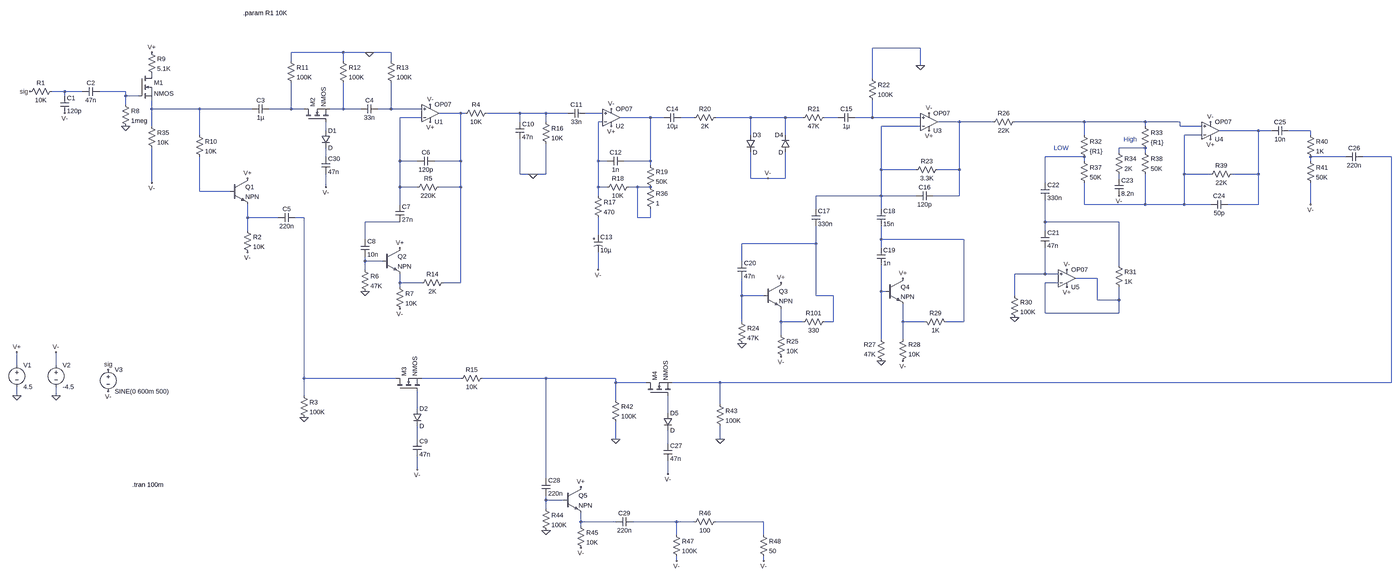
[diagram p0: schematic pedal design.asc, whole sheet]
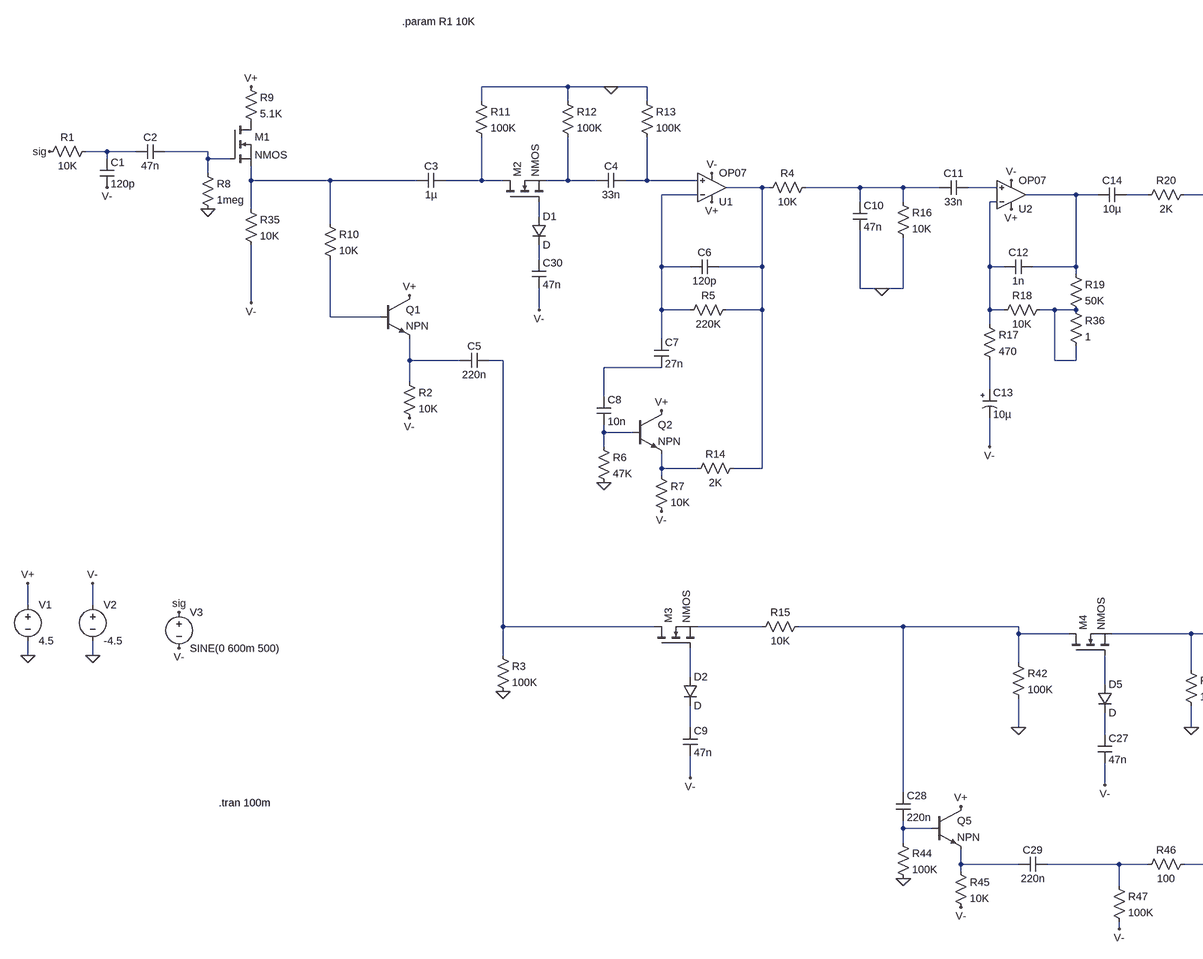
[diagram p1: schematic pedal design.asc, part, row 1 of 1, column 1 of 2]
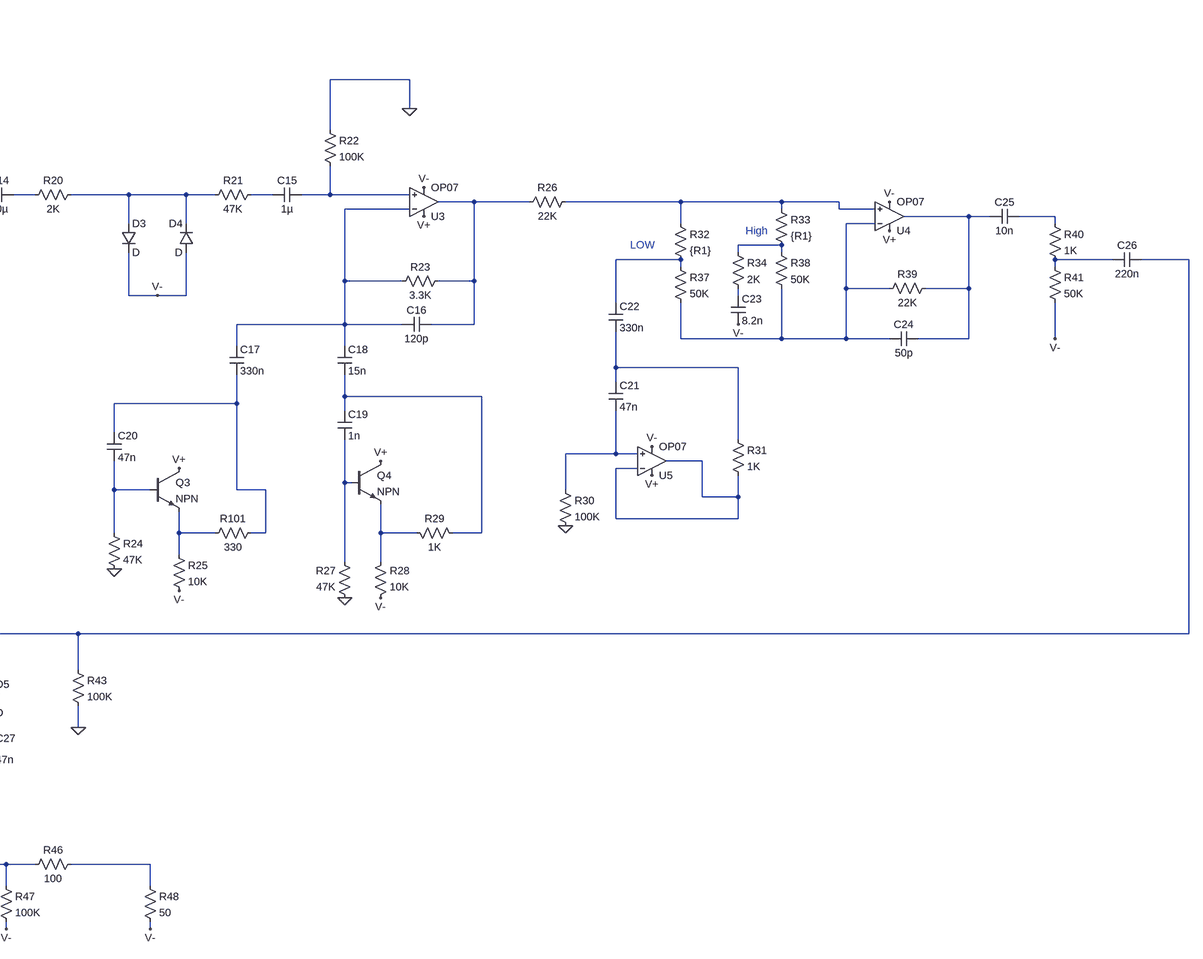
[diagram p2: schematic pedal design.asc, part, row 1 of 1, column 2 of 2]
pedal design.asc, the LTspice schematic file:
Version 4
SHEET 1 4968 1980
WIRE 3168 32 2992 32
WIRE 1040 48 848 48
WIRE 1136 48 1040 48
WIRE 1216 48 1136 48
WIRE 848 80 848 48
WIRE 1040 80 1040 48
WIRE 1216 80 1216 48
WIRE 3168 96 3168 32
WIRE 2992 144 2992 32
WIRE 16 192 -32 192
WIRE 80 192 16 192
WIRE 240 192 144 192
WIRE 16 208 16 192
WIRE 240 208 240 192
WIRE 288 208 240 208
WIRE 240 240 240 208
WIRE 336 256 336 224
WIRE 512 256 336 256
WIRE 704 256 512 256
WIRE 848 256 848 160
WIRE 848 256 768 256
WIRE 896 256 848 256
WIRE 1040 256 1040 160
WIRE 1040 256 992 256
WIRE 1104 256 1040 256
WIRE 1216 256 1216 160
WIRE 1216 256 1168 256
WIRE 1328 256 1216 256
WIRE 1472 272 1392 272
WIRE 1488 272 1472 272
WIRE 1696 272 1568 272
WIRE 1792 272 1696 272
WIRE 1872 272 1792 272
WIRE 2000 272 1936 272
WIRE 1328 288 1248 288
WIRE 2176 288 2064 288
WIRE 2224 288 2176 288
WIRE 2336 288 2288 288
WIRE 2544 288 2416 288
WIRE 2672 288 2544 288
WIRE 2736 288 2672 288
WIRE 2864 288 2816 288
WIRE 2992 288 2992 224
WIRE 2992 288 2928 288
WIRE 3168 288 2992 288
WIRE 1696 304 1696 272
WIRE 1792 304 1792 272
WIRE 2000 304 1984 304
WIRE 3312 304 3232 304
WIRE 3488 304 3312 304
WIRE 3824 304 3568 304
WIRE 4048 304 3824 304
WIRE 4176 304 4048 304
WIRE 336 320 336 256
WIRE 3168 320 3024 320
WIRE 4048 320 4048 304
WIRE 4176 320 4176 304
WIRE 4256 320 4176 320
WIRE 976 336 976 304
WIRE 4464 336 4320 336
WIRE 4512 336 4464 336
WIRE 4656 336 4576 336
WIRE 512 352 512 256
WIRE 2544 352 2544 288
WIRE 2672 352 2672 288
WIRE 3824 352 3824 304
WIRE 4256 352 4192 352
WIRE 4656 352 4656 336
WIRE 4048 400 3952 400
WIRE 3952 416 3952 400
WIRE 4048 416 4048 400
WIRE 976 432 976 400
WIRE 3824 432 3680 432
WIRE 4784 432 4656 432
WIRE 4960 432 4848 432
WIRE 1248 448 1248 288
WIRE 1312 448 1248 448
WIRE 1472 448 1472 272
WIRE 1472 448 1376 448
WIRE 1984 448 1984 304
WIRE 2016 448 1984 448
WIRE 2176 448 2176 288
WIRE 2176 448 2080 448
WIRE 3824 448 3824 432
WIRE 4656 448 4656 432
WIRE 2176 464 2176 448
WIRE 3024 480 3024 320
WIRE 3152 480 3024 480
WIRE 3312 480 3312 304
WIRE 3312 480 3232 480
WIRE 1696 496 1696 368
WIRE 1744 496 1696 496
WIRE 1792 496 1792 384
WIRE 1792 496 1744 496
WIRE 4192 496 4192 352
WIRE 4288 496 4192 496
WIRE 4464 496 4464 336
WIRE 4464 496 4368 496
WIRE 2544 512 2544 416
WIRE 2608 512 2544 512
WIRE 2672 512 2672 416
WIRE 2672 512 2608 512
WIRE 3952 512 3952 496
WIRE 336 528 336 400
WIRE 3680 528 3680 432
WIRE 976 544 976 496
WIRE 1248 544 1248 448
WIRE 1312 544 1248 544
WIRE 1472 544 1472 448
WIRE 1472 544 1392 544
WIRE 1984 544 1984 448
WIRE 2016 544 1984 544
WIRE 2128 544 2096 544
WIRE 2176 544 2128 544
WIRE 512 560 512 432
WIRE 624 560 512 560
WIRE 1984 576 1984 544
WIRE 3024 576 3024 480
WIRE 3024 576 2784 576
WIRE 3152 576 3024 576
WIRE 3312 576 3312 480
WIRE 3312 576 3216 576
WIRE 1248 608 1248 544
WIRE 3824 608 3824 528
WIRE 4048 608 4048 496
WIRE 4048 608 3824 608
WIRE 4192 608 4192 496
WIRE 4192 608 4048 608
WIRE 4288 608 4192 608
WIRE 4464 608 4464 496
WIRE 4464 608 4352 608
WIRE 4656 608 4656 528
WIRE 2784 624 2784 576
WIRE 3024 624 3024 576
WIRE 688 656 688 608
WIRE 800 656 688 656
WIRE 896 656 864 656
WIRE 2128 656 2128 544
WIRE 2176 656 2176 624
WIRE 2176 656 2128 656
WIRE 1248 672 1120 672
WIRE 3680 672 3680 592
WIRE 3952 672 3680 672
WIRE 688 704 688 656
WIRE 3680 704 3680 672
WIRE 1984 720 1984 656
WIRE 1120 736 1120 672
WIRE 3024 736 3024 688
WIRE 3328 736 3024 736
WIRE 2784 752 2784 688
WIRE 2784 752 2512 752
WIRE 3024 768 3024 736
WIRE 1120 816 1120 800
WIRE 1184 816 1120 816
WIRE 2512 816 2512 752
WIRE 3952 832 3952 672
WIRE 1120 848 1120 816
WIRE 1984 848 1984 784
WIRE 3680 864 3680 768
WIRE 3680 864 3568 864
WIRE 3728 864 3680 864
WIRE 3872 880 3792 880
WIRE 1248 896 1248 864
WIRE 1328 896 1248 896
WIRE 1472 896 1472 544
WIRE 1472 896 1408 896
WIRE 3728 896 3680 896
WIRE 1248 912 1248 896
WIRE 3024 928 3024 832
WIRE 3040 928 3024 928
WIRE 2512 944 2512 880
WIRE 2592 944 2512 944
WIRE 2784 944 2784 752
WIRE 2848 944 2784 944
WIRE 3568 944 3568 864
WIRE 3872 960 3872 880
WIRE 3952 960 3952 912
WIRE 3952 960 3872 960
WIRE 3680 1008 3680 896
WIRE 3952 1008 3952 960
WIRE 3952 1008 3680 1008
WIRE 2512 1040 2512 944
WIRE 2656 1040 2656 992
WIRE 2736 1040 2656 1040
WIRE 2848 1040 2848 944
WIRE 2848 1040 2816 1040
WIRE 3104 1040 3104 976
WIRE 3184 1040 3104 1040
WIRE 3328 1040 3328 736
WIRE 3328 1040 3264 1040
WIRE 2656 1088 2656 1040
WIRE 3024 1104 3024 928
WIRE 3104 1104 3104 1040
WIRE -160 1200 -160 1152
WIRE -16 1200 -16 1152
WIRE 896 1248 896 656
WIRE 1232 1248 896 1248
WIRE 1472 1248 1328 1248
WIRE 1792 1248 1552 1248
WIRE 2048 1248 1792 1248
WIRE 2048 1264 2048 1248
WIRE 2160 1264 2048 1264
WIRE 2432 1264 2256 1264
WIRE 4960 1264 4960 432
WIRE 4960 1264 2432 1264
WIRE -160 1312 -160 1280
WIRE -16 1312 -16 1280
WIRE 896 1312 896 1248
WIRE 2048 1328 2048 1264
WIRE 2432 1344 2432 1264
WIRE 1312 1360 1312 1296
WIRE 2240 1376 2240 1312
WIRE 1312 1472 1312 1424
WIRE 2048 1472 2048 1408
WIRE 2432 1472 2432 1424
WIRE 2240 1488 2240 1440
WIRE 1312 1584 1312 1536
WIRE 2240 1600 2240 1552
WIRE 1792 1616 1792 1248
WIRE 1792 1696 1792 1680
WIRE 1856 1696 1792 1696
WIRE 1792 1728 1792 1696
WIRE 1920 1776 1920 1744
WIRE 2048 1776 1920 1776
WIRE 2272 1776 2112 1776
WIRE 2336 1776 2272 1776
WIRE 2592 1776 2416 1776
WIRE 1920 1792 1920 1776
WIRE 2272 1824 2272 1776
WIRE 2592 1824 2592 1776
WIRE 2272 1920 2272 1904
WIRE 2592 1920 2592 1904
FLAG 1136 48 0
FLAG 896 1392 0
FLAG 1120 928 0
FLAG 3168 96 0
FLAG 2512 1120 0
FLAG 3024 1184 0
FLAG 3568 1024 0
FLAG -160 1312 0
FLAG -16 1312 0
FLAG -160 1152 V+
FLAG -16 1152 V-
FLAG 240 320 0
FLAG 336 48 V+
FLAG 336 528 V-
FLAG 16 272 V-
FLAG 688 512 V+
FLAG 1360 304 V+
FLAG 1360 240 V-
FLAG 1248 768 V+
FLAG 1248 992 V-
FLAG 688 784 V-
FLAG 1744 496 0
FLAG 2032 320 V+
FLAG 2032 256 V-
FLAG 1984 848 V-
FLAG 2608 512 V-
FLAG 3200 336 V+
FLAG 3200 272 V-
FLAG 2656 896 V+
FLAG 3104 880 V+
FLAG 2656 1168 V-
FLAG 3104 1184 V-
FLAG 3760 912 V+
FLAG 3760 848 V-
FLAG 3952 576 V-
FLAG 4288 368 V+
FLAG 4288 304 V-
FLAG 4656 608 V-
FLAG 1312 1584 V-
FLAG 2240 1600 V-
FLAG 2048 1472 0
FLAG 2432 1472 0
FLAG 1792 1808 0
FLAG 1920 1648 V+
FLAG 1920 1872 V-
FLAG 2272 1920 V-
FLAG 2592 1920 V-
FLAG -112 192 sig
FLAG 176 1216 sig
FLAG 176 1296 V-
FLAG 976 544 V-
SYMBOL res -16 176 R90
WINDOW 0 0 56 VBottom 2
WINDOW 3 32 56 VTop 2
SYMATTR InstName R1
SYMATTR Value 10K
SYMBOL cap 0 208 R0
SYMATTR InstName C1
SYMATTR Value 120p
SYMBOL cap 144 176 R90
WINDOW 0 0 32 VBottom 2
WINDOW 3 32 32 VTop 2
SYMATTR InstName C2
SYMATTR Value 47n
SYMBOL res 224 224 R0
SYMATTR InstName R8
SYMATTR Value 1meg
SYMBOL res 320 32 R0
SYMATTR InstName R9
SYMATTR Value 5.1K
SYMBOL res 496 336 R0
SYMATTR InstName R10
SYMATTR Value 10K
SYMBOL nmos 288 128 R0
SYMATTR InstName M1
SYMBOL cap 768 240 R90
WINDOW 0 0 32 VBottom 2
WINDOW 3 32 32 VTop 2
SYMATTR InstName C3
SYMATTR Value 1µ
SYMBOL res 832 64 R0
SYMATTR InstName R11
SYMATTR Value 100K
SYMBOL res 1024 64 R0
SYMATTR InstName R12
SYMATTR Value 100K
SYMBOL res 1200 64 R0
SYMATTR InstName R13
SYMATTR Value 100K
SYMBOL cap 1168 240 R90
WINDOW 0 0 32 VBottom 2
WINDOW 3 32 32 VTop 2
SYMATTR InstName C4
SYMATTR Value 33n
SYMBOL nmos 896 304 R270
SYMATTR InstName M2
SYMBOL diode 960 336 R0
SYMATTR InstName D1
SYMBOL npn 624 512 R0
SYMATTR InstName Q1
SYMBOL res 672 688 R0
SYMATTR InstName R2
SYMATTR Value 10K
SYMBOL res 880 1296 R0
SYMATTR InstName R3
SYMATTR Value 100K
SYMBOL cap 864 640 R90
WINDOW 0 0 32 VBottom 2
WINDOW 3 32 32 VTop 2
SYMATTR InstName C5
SYMATTR Value 220n
SYMBOL res 1584 256 R90
WINDOW 0 0 56 VBottom 2
WINDOW 3 32 56 VTop 2
SYMATTR InstName R4
SYMATTR Value 10K
SYMBOL res 1408 528 R90
WINDOW 0 0 56 VBottom 2
WINDOW 3 32 56 VTop 2
SYMATTR InstName R5
SYMATTR Value 220K
SYMBOL cap 1376 432 R90
WINDOW 0 0 32 VBottom 2
WINDOW 3 32 32 VTop 2
SYMATTR InstName C6
SYMATTR Value 120p
SYMBOL npn 1184 768 R0
SYMATTR InstName Q2
SYMBOL cap 1232 608 R0
SYMATTR InstName C7
SYMATTR Value 27n
SYMBOL cap 1104 736 R0
SYMATTR InstName C8
SYMATTR Value 10n
SYMBOL res 1104 832 R0
SYMATTR InstName R6
SYMATTR Value 47K
SYMBOL res 1232 896 R0
SYMATTR InstName R7
SYMATTR Value 10K
SYMBOL res 1424 880 R90
WINDOW 0 0 56 VBottom 2
WINDOW 3 32 56 VTop 2
SYMATTR InstName R14
SYMATTR Value 2K
SYMBOL nmos 1232 1296 R270
SYMATTR InstName M3
SYMBOL diode 1296 1360 R0
SYMATTR InstName D2
SYMBOL cap 1296 1472 R0
SYMATTR InstName C9
SYMATTR Value 47n
SYMBOL res 1568 1232 R90
WINDOW 0 0 56 VBottom 2
WINDOW 3 32 56 VTop 2
SYMATTR InstName R15
SYMATTR Value 10K
SYMBOL cap 1680 304 R0
SYMATTR InstName C10
SYMATTR Value 47n
SYMBOL cap 1936 256 R90
WINDOW 0 0 32 VBottom 2
WINDOW 3 32 32 VTop 2
SYMATTR InstName C11
SYMATTR Value 33n
SYMBOL res 1776 288 R0
SYMATTR InstName R16
SYMATTR Value 10K
SYMBOL cap 2080 432 R90
WINDOW 0 0 32 VBottom 2
WINDOW 3 32 32 VTop 2
SYMATTR InstName C12
SYMATTR Value 1n
SYMBOL res 1968 560 R0
SYMATTR InstName R17
SYMATTR Value 470
SYMBOL res 2112 528 R90
WINDOW 0 0 56 VBottom 2
WINDOW 3 32 56 VTop 2
SYMATTR InstName R18
SYMATTR Value 10K
SYMBOL res 2160 448 R0
SYMATTR InstName R19
SYMATTR Value 50K
SYMBOL polcap 1968 720 R0
SYMATTR InstName C13
SYMATTR Value 10µ
SYMBOL cap 2288 272 R90
WINDOW 0 0 32 VBottom 2
WINDOW 3 32 32 VTop 2
SYMATTR InstName C14
SYMATTR Value 10µ
SYMBOL res 2432 272 R90
WINDOW 0 0 56 VBottom 2
WINDOW 3 32 56 VTop 2
SYMATTR InstName R20
SYMATTR Value 2K
SYMBOL diode 2528 352 R0
SYMATTR InstName D3
SYMBOL diode 2688 416 R180
WINDOW 0 24 64 Left 2
WINDOW 3 24 0 Left 2
SYMATTR InstName D4
SYMBOL res 2832 272 R90
WINDOW 0 0 56 VBottom 2
WINDOW 3 32 56 VTop 2
SYMATTR InstName R21
SYMATTR Value 47K
SYMBOL cap 2928 272 R90
WINDOW 0 0 32 VBottom 2
WINDOW 3 32 32 VTop 2
SYMATTR InstName C15
SYMATTR Value 1µ
SYMBOL res 2976 128 R0
SYMATTR InstName R22
SYMATTR Value 100K
SYMBOL res 3248 464 R90
WINDOW 0 0 56 VBottom 2
WINDOW 3 32 56 VTop 2
SYMATTR InstName R23
SYMATTR Value 3.3K
SYMBOL cap 3216 560 R90
WINDOW 0 0 32 VBottom 2
WINDOW 3 32 32 VTop 2
SYMATTR InstName C16
SYMATTR Value 120p
SYMBOL cap 2768 624 R0
SYMATTR InstName C17
SYMATTR Value 330n
SYMBOL cap 3008 624 R0
SYMATTR InstName C18
SYMATTR Value 15n
SYMBOL cap 3008 768 R0
SYMATTR InstName C19
SYMATTR Value 1n
SYMBOL cap 2496 816 R0
SYMATTR InstName C20
SYMATTR Value 47n
SYMBOL npn 2592 896 R0
SYMATTR InstName Q3
SYMBOL npn 3040 880 R0
SYMATTR InstName Q4
SYMBOL res 2496 1024 R0
SYMATTR InstName R24
SYMATTR Value 47K
SYMBOL res 2640 1072 R0
SYMATTR InstName R25
SYMATTR Value 10K
SYMBOL res 2832 1024 R90
WINDOW 0 0 56 VBottom 2
WINDOW 3 32 56 VTop 2
SYMATTR InstName R101
SYMATTR Value 330
SYMBOL res 3040 1200 R180
WINDOW 0 36 76 Left 2
WINDOW 3 36 40 Left 2
SYMATTR InstName R27
SYMATTR Value 47K
SYMBOL res 3088 1200 M180
WINDOW 0 36 76 Left 2
WINDOW 3 36 40 Left 2
SYMATTR InstName R28
SYMATTR Value 10K
SYMBOL res 3168 1024 M90
WINDOW 0 0 56 VBottom 2
WINDOW 3 32 56 VTop 2
SYMATTR InstName R29
SYMATTR Value 1K
SYMBOL res 3584 288 R90
WINDOW 0 0 56 VBottom 2
WINDOW 3 32 56 VTop 2
SYMATTR InstName R26
SYMATTR Value 22K
SYMBOL cap 3664 704 R0
SYMATTR InstName C21
SYMATTR Value 47n
SYMBOL cap 3664 528 R0
SYMATTR InstName C22
SYMATTR Value 330n
SYMBOL res 3552 928 R0
SYMATTR InstName R30
SYMATTR Value 100K
SYMBOL res 3936 816 R0
SYMATTR InstName R31
SYMATTR Value 1K
SYMBOL res 3808 336 R0
SYMATTR InstName R32
SYMATTR Value {R1}
SYMBOL res 3936 400 R0
SYMATTR InstName R34
SYMATTR Value 2K
SYMBOL voltage -160 1184 R0
SYMATTR InstName V1
SYMATTR Value 4.5
SYMBOL voltage -16 1184 R0
SYMATTR InstName V2
SYMATTR Value -4.5
SYMBOL res 320 304 R0
SYMATTR InstName R35
SYMATTR Value 10K
SYMBOL res 2160 528 R0
SYMATTR InstName R36
SYMATTR Value 1
SYMBOL res 3808 432 R0
SYMATTR InstName R37
SYMATTR Value 50K
SYMBOL res 4032 304 R0
SYMATTR InstName R33
SYMATTR Value {R1}
SYMBOL res 4032 400 R0
SYMATTR InstName R38
SYMATTR Value 50K
SYMBOL cap 3936 512 R0
SYMATTR InstName C23
SYMATTR Value 8.2n
SYMBOL res 4384 480 R90
WINDOW 0 0 56 VBottom 2
WINDOW 3 32 56 VTop 2
SYMATTR InstName R39
SYMATTR Value 22K
SYMBOL cap 4352 592 R90
WINDOW 0 0 32 VBottom 2
WINDOW 3 32 32 VTop 2
SYMATTR InstName C24
SYMATTR Value 50p
SYMBOL cap 4576 320 R90
WINDOW 0 0 32 VBottom 2
WINDOW 3 32 32 VTop 2
SYMATTR InstName C25
SYMATTR Value 10n
SYMBOL res 4640 336 R0
SYMATTR InstName R40
SYMATTR Value 1K
SYMBOL res 4640 432 R0
SYMATTR InstName R41
SYMATTR Value 50K
SYMBOL cap 4848 416 R90
WINDOW 0 0 32 VBottom 2
WINDOW 3 32 32 VTop 2
SYMATTR InstName C26
SYMATTR Value 220n
SYMBOL nmos 2160 1312 R270
SYMATTR InstName M4
SYMBOL diode 2224 1376 R0
SYMATTR InstName D5
SYMBOL cap 2224 1488 R0
SYMATTR InstName C27
SYMATTR Value 47n
SYMBOL res 2032 1312 R0
SYMATTR InstName R42
SYMATTR Value 100K
SYMBOL res 2416 1328 R0
SYMATTR InstName R43
SYMATTR Value 100K
SYMBOL npn 1856 1648 R0
SYMATTR InstName Q5
SYMBOL cap 1776 1616 R0
SYMATTR InstName C28
SYMATTR Value 220n
SYMBOL res 1776 1712 R0
SYMATTR InstName R44
SYMATTR Value 100K
SYMBOL res 1904 1776 R0
SYMATTR InstName R45
SYMATTR Value 10K
SYMBOL res 2432 1760 R90
WINDOW 0 0 56 VBottom 2
WINDOW 3 32 56 VTop 2
SYMATTR InstName R46
SYMATTR Value 100
SYMBOL res 2256 1808 R0
SYMATTR InstName R47
SYMATTR Value 100K
SYMBOL cap 2112 1760 R90
WINDOW 0 0 32 VBottom 2
WINDOW 3 32 32 VTop 2
SYMATTR InstName C29
SYMATTR Value 220n
SYMBOL res 2576 1808 R0
SYMATTR InstName R48
SYMATTR Value 50
SYMBOL voltage 176 1200 R0
SYMATTR InstName V3
SYMATTR Value SINE(0 600m 500)
SYMBOL OP07 1360 336 M180
SYMATTR InstName U1
SYMBOL OP07 2032 352 M180
SYMATTR InstName U2
SYMBOL OP07 3200 368 M180
SYMATTR InstName U3
SYMBOL OP07 4288 400 M180
SYMATTR InstName U4
SYMBOL OP07 3760 944 M180
SYMATTR InstName U5
SYMBOL cap 960 432 R0
SYMATTR InstName C30
SYMATTR Value 47n
TEXT 264 1640 Left 2 !.tran 100m
TEXT 3712 400 Left 2 ;LOW
TEXT 3968 368 Left 2 ;High
TEXT 672 -184 Left 2 !.param R1 10K

The netlist it stands for:
* pedal design.asc
R1 N001 sig 10K
C1 N001 V- 120p
C2 N002 N001 47n
R8 N002 0 1meg
R9 V+ P001 5.1K
R10 N003 N031 10K
M1 P001 N002 N003 N003 NMOS
C3 N004 N003 1µ
R11 0 N004 100K
R12 0 N005 100K
R13 0 N006 100K
C4 N006 N005 33n
M2 N004 N020 N005 N005 NMOS
D1 N020 N025 D
Q1 V+ N031 N032 0 NPN
R2 N032 V- 10K
R3 N033 0 100K
C5 N033 N032 220n
R4 N008 N007 10K
R5 N007 N010 220K
C6 N007 N010 120p
Q2 V+ N039 N042 0 NPN
C7 N010 N034 27n
C8 N034 N039 10n
R6 N039 0 47K
R7 N042 V- 10K
R14 N007 N042 2K
M3 N033 N049 N047 N047 NMOS
D2 N049 N051 D
C9 N051 V- 47n
R15 N048 N047 10K
C10 N008 0 47n
C11 N009 N008 33n
R16 N008 0 10K
C12 N011 N016 1n
R17 N016 N036 470
R18 N030 N016 10K
R19 N011 N030 50K
C13 N036 V- 10µ
C14 N012 N011 10µ
R20 N013 N012 2K
D3 N013 V- D
D4 V- N013 D
R21 N014 N013 47K
C15 N015 N014 1µ
R22 0 N015 100K
R23 N017 N019 3.3K
C16 N017 N019 120p
C17 N019 N038 330n
C18 N019 N037 15n
C19 N037 N043 1n
C20 N038 N044 47n
Q3 V+ N044 N045 0 NPN
Q4 V+ N043 N046 0 NPN
R24 N044 0 47K
R25 N045 V- 10K
R101 N038 N045 330
R27 0 N043 47K
R28 V- N046 10K
R29 N046 N037 1K
R26 N018 N017 22K
C21 N035 N040 47n
C22 N026 N035 330n
R30 N040 0 100K
R31 N035 N041 1K
R32 N018 N026 {R1}
R34 N024 N029 2K
V1 V+ 0 4.5
V2 V- 0 -4.5
R35 N003 V- 10K
R36 N030 N030 1
R37 N026 N023 50K
R33 N018 N024 {R1}
R38 N024 N023 50K
C23 N029 V- 8.2n
R39 N021 N023 22K
C24 N021 N023 50p
C25 N022 N021 10n
R40 N022 N027 1K
R41 N027 V- 50K
C26 N028 N027 220n
M4 N048 N050 N028 N028 NMOS
D5 N050 N052 D
C27 N052 V- 47n
R42 N048 0 100K
R43 N028 0 100K
Q5 V+ N053 N054 0 NPN
C28 N048 N053 220n
R44 N053 0 100K
R45 N054 V- 10K
R46 N056 N055 100
R47 N055 V- 100K
C29 N055 N054 220n
R48 N056 V- 50
V3 sig V- SINE(0 600m 500)
XU1 N006 N010 V+ V- N007 LT1001  ; OP07, pins In+ In- V+ V- OUT
XU2 N009 N016 V+ V- N011 LT1001  ; OP07, pins In+ In- V+ V- OUT
XU3 N015 N019 V+ V- N017 LT1001  ; OP07, pins In+ In- V+ V- OUT
XU4 N018 N023 V+ V- N021 LT1001  ; OP07, pins In+ In- V+ V- OUT
XU5 N040 N041 V+ V- N041 LT1001  ; OP07, pins In+ In- V+ V- OUT
C30 N025 V- 47n
.model D D
.lib standard.dio
.model NPN NPN
.model PNP PNP
.lib standard.bjt
.model NMOS NMOS
.model PMOS PMOS
.lib standard.mos
.tran 100m
* LOW
* High
.param R1 10K
.lib LTC.lib
.backanno
.end